# Altium project 415dk.PrjPcb
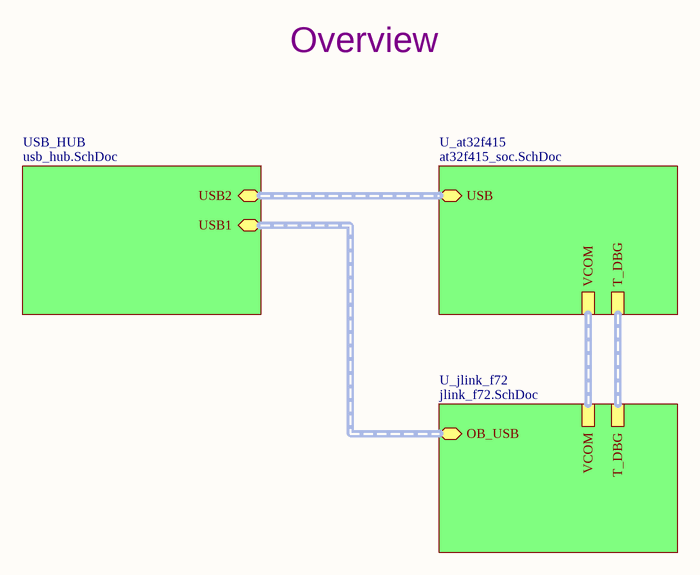
[diagram p0: 415dk.SchDoc]
_Revision_: A; _ProjectName_: 415DK
4 sheets, 63 parts. Net scope: hierarchical (ports join the sheet entries above them; power ports are global).
Board file: 415dk.PcbDoc
Sheets:
  415dk.SchDoc
    U_at32f415 = at32f415_soc.SchDoc
    U_jlink_f72 = jlink_f72.SchDoc
    USB_HUB = usb_hub.SchDoc

## Sheet 415dk.SchDoc
size A4; DocumentNumber: 1; SheetNumber: 1; SheetTotal: 4

### Sub-sheets
U_at32f415 = at32f415_soc.SchDoc: T_DBG (harness DBG_PORT), VCOM (harness VCOM), USB (harness USB)
U_jlink_f72 = jlink_f72.SchDoc: T_DBG (harness DBG_PORT), VCOM (harness VCOM), OB_USB (harness USB)
USB_HUB = usb_hub.SchDoc: USB1, USB2

### Buses and harness runs
harness sheet U_at32f415/T_DBG = sheet U_jlink_f72/T_DBG
harness sheet U_at32f415/USB = sheet USB_HUB/USB2
harness sheet U_at32f415/VCOM = sheet U_jlink_f72/VCOM
harness sheet U_jlink_f72/OB_USB = sheet USB_HUB/USB1

### Notes on the sheet
- Overview

## Sheet at32f415_soc.SchDoc
size A4; DocumentNumber: 2; SheetNumber: 2; SheetTotal: 4
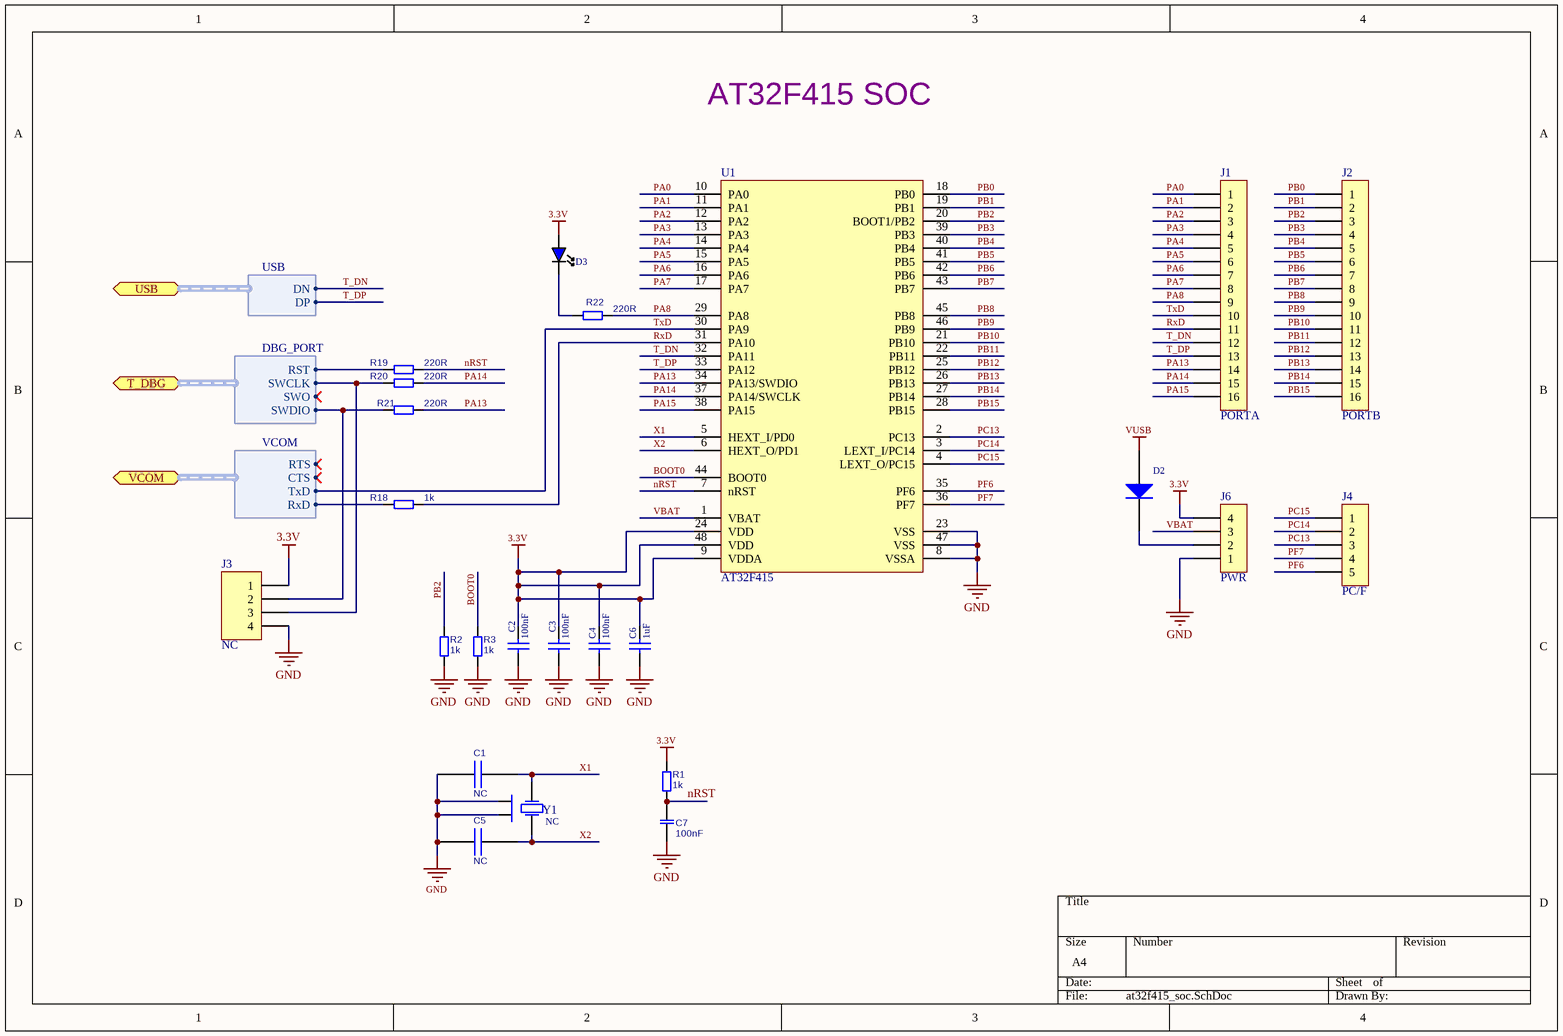
[diagram p1: at32f415_soc.SchDoc]

### Parts
C1  NC  [C0402]  (no BOM)
C2  100nF  [C0402]
C3  100nF  [C0402]
C4  100nF  [C0402]
C5  NC  [C0402]  (no BOM)
C6  1uF  [C0603]
C7  100nF  [C0402]
D2  Diode  [SOD123]  (value not drawn)
D3  User LED  [LED0603]  (value not drawn)
J1  PORTA  [HDR1X16]  (no BOM)
J2  PORTB  [HDR1X16]  (no BOM)
J3  NC  [HDR1X4]  (no BOM)
J4  PC/F  [HDR1X5]  (no BOM)
J6  PWR  [HDR1X4]  (no BOM)
R1  1k  [R0402]
R2  1k  [R0402]
R3  1k  [R0402]
R18  1k  [R0402]
R19  220R  [R0402]
R20  220R  [R0402]
R21  220R  [R0402]
R22  220R  [R0402]
U1  AT32F415  [LQFP48_M]
Y1  NC  [XTAL_3225]  (no BOM)

### Ports
T_DBG (harness DBG_PORT), USB (harness USB), VCOM (harness VCOM)

### Harnesses
DBG_PORT: RST, SWCLK, SWDIO, SWO
VCOM: RTS, CTS, RxD, TxD
USB: DP, DN

### Nets
3.3V: C2.1 C3.1 C4.1 C6.1 D3.A J3.1 J6.4 R1.1(K) U1.9(VDDA) U1.24(VDD) U1.48(VDD)
GND: C1.1(P) C2.2 C3.2 C4.2 C5.1(P) C6.2 C7.1(K) J3.4 J6.1 R2.1(K) R3.2(A) U1.8(VSSA) U1.23(VSS) U1.47(VSS) Y1.2 Y1.4(X2)
VUSB: D2.A
BOOT0: R3.1(K) U1.44(BOOT0)  [project net BOOT0_2]
nRST: C7.2(A) R1.2(A) R19.1(K) U1.7(nRST)  [project net nRST_2]
PA0: J1.1 U1.10(PA0)  [project net PA0_2]
PA1: J1.2 U1.11(PA1)  [project net PA1_2]
PA2: J1.3 U1.12(PA2)  [project net PA2_2]
PA3: J1.4 U1.13(PA3)  [project net PA3_2]
PA4: J1.5 U1.14(PA4)  [project net PA4_2]
PA5: J1.6 U1.15(PA5)  [project net PA5_2]
PA6: J1.7 U1.16(PA6)  [project net PA6_2]
PA7: J1.8 U1.17(PA7)  [project net PA7_2]
PA8: J1.9 R22.1(K) U1.29(PA8)  [project net PA8_2]
PA13: J1.14 R21.1(K) U1.34(PA13/SWDIO)  [project net PA13_2]
PA14: J1.15 R20.1(K) U1.37(PA14/SWCLK)  [project net PA14_2]
PA15: J1.16 U1.38(PA15)  [project net PA15_2]
PB0: J2.1 U1.18(PB0)  [project net PB0_2]
PB1: J2.2 U1.19(PB1)  [project net PB1_2]
PB2: J2.3 R2.2(A) U1.20(BOOT1/PB2)  [project net PB2_2]
PB3: J2.4 U1.39(PB3)  [project net PB3_2]
PB4: J2.5 U1.40(PB4)  [project net PB4_2]
PB5: J2.6 U1.41(PB5)  [project net PB5_2]
PB6: J2.7 U1.42(PB6)  [project net PB6_2]
PB7: J2.8 U1.43(PB7)  [project net PB7_2]
PB8: J2.9 U1.45(PB8)  [project net PB8_2]
PB9: J2.10 U1.46(PB9)  [project net PB9_2]
PB10: J2.11 U1.21(PB10)  [project net PB10_2]
PB11: J2.12 U1.22(PB11)  [project net PB11_2]
PB12: J2.13 U1.25(PB12)  [project net PB12_2]
PB13: J2.14 U1.26(PB13)  [project net PB13_2]
PB14: J2.15 U1.27(PB14)  [project net PB14_2]
PB15: J2.16 U1.28(PB15)  [project net PB15_2]
PC13: J4.3 U1.2(PC13)  [project net PC13_2]
PC14: J4.2 U1.3(LEXT_I/PC14)  [project net PC14_2]
PC15: J4.1 U1.4(LEXT_O/PC15)  [project net PC15_2]
PF6: J4.5 U1.35(PF6)  [project net PF6_2]
PF7: J4.4 U1.36(PF7)  [project net PF7_2]
RxD: J1.11 R18.2(A) U1.31(PA10)  [project net RxD_2]
T_DN: J1.12 U1.32(PA11) ; port USB.DN
T_DP: J1.13 U1.33(PA12) ; port USB.DP
T_nRST: R19.2(A) ; port T_DBG.RST
T_RxD: R18.1(K) ; port VCOM.RxD
T_SWCLK: J3.3 R20.2(A) ; port T_DBG.SWCLK
T_SWDIO: J3.2 R21.2(A) ; port T_DBG.SWDIO
TxD: J1.10 U1.30(PA9) ; port VCOM.TxD  [project net T_TxD]
VBAT: J6.3 U1.1(VBAT)  [project net VBAT_2]
X1: C1.2(N) U1.5(HEXT_I/PD0) Y1.1(X1)  [project net X1_2]
X2: C5.2(N) U1.6(HEXT_O/PD1) Y1.3(X2)  [project net X2_2]
NetD2_K: D2.K J6.2
NetD3_k: D3.k R22.2(A)

### Notes on the sheet
- AT32F415 SOC

### Library data of the parts
C1 C5 = Cap1: Ceramic Capacitor; Type: SMD; ComponentLink1URL: *; ComponentLink1Description: *; Tolerance: *; Value: NC
C2-C4 C6 = Cap: Capacitor; Published: 8-Jun-2000; LatestRevisionDate: 17-Jul-2002; LatestRevisionNote: Re-released for DXP Platform.; PackageReference: RAD-0.3; Publisher: Altium Limited; PackageDescription: Radial Cap, Thru-Hole; 2 Leads; 0.3 in Pin Spacing
  C2-C4: Value: 100nF
  C6: Value: 1uF
C7 = Cap: Ceramic Capacitor; Type: SMD; ComponentLink1URL: *; ComponentLink1Description: *; Tolerance: *; Value: 100nF
D2 = Diode: Generic Diode; Value: *
D3 = LED_BLUE: Green LED; Part Number: 150060VS75020; Value: *
J1 J2 = HEADER1x16: 100mil, 1x16 header
J3 = Header 4: Header, 4-Pin; LatestRevisionDate: 17-Jul-2002; LatestRevisionNote: Re-released for DXP Platform.; Value: NC
J4 = HEADER1X5: 100mil, 1x5 header
J6 = HEADER1X4: 100mil, 1x4 header
R1-R3 R18-R22 = Res: Resistor; ComponentLink1URL: *; ComponentLink1Description: *; Tolerance: *; Type: SMD
  R1-R3 R18: Value: 1k
  R19-R22: Value: 220R
U1 = AT32F415: Cortex-M4 MCU
Y1 = XTAL_4_PIN: 12Mhz CERAMIC SMD CRYSTAL; Value: NC; ComponentLink1Description: DataSheet

## Sheet jlink_f72.SchDoc
size A4; DocumentNumber: 3; SheetNumber: 3; SheetTotal: 4
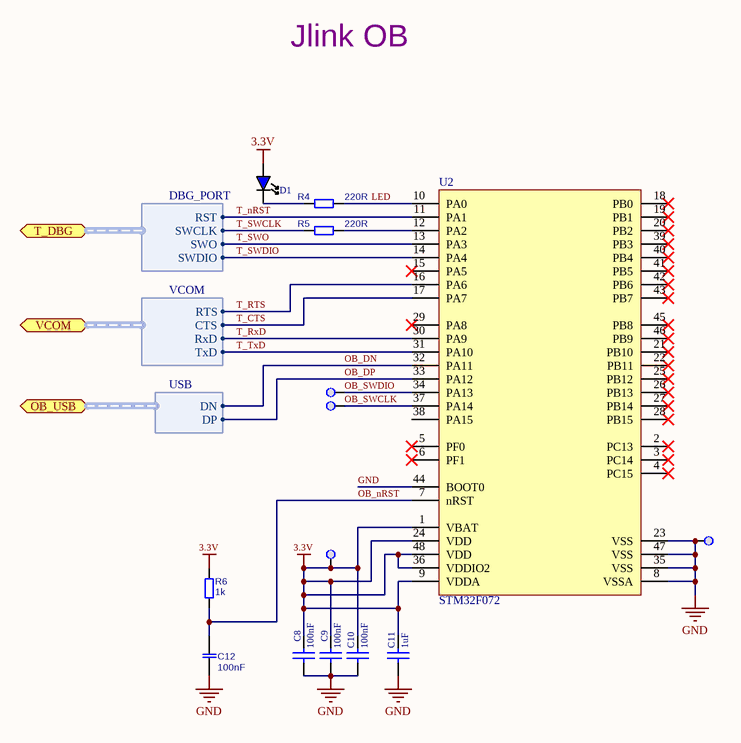
[diagram p2: jlink_f72.SchDoc]

### Parts
C8  100nF  [C0402]
C9  100nF  [C0402]
C10  100nF  [C0402]
C11  1uF  [C0603]
C12  100nF  [C0402]
D1  Debugger LED  [LED0603]  (value not drawn)
R4  220R  [R0402]
R5  220R  [R0402]
R6  1k  [R0402]
TP1  TestPoint  [PAD1_07]  (value not drawn)  (no BOM)
TP2  TestPoint  [PAD1_07]  (value not drawn)  (no BOM)
TP3  TestPoint  [PAD1_07]  (value not drawn)  (no BOM)
TP4  TestPoint  [PAD1_07]  (value not drawn)  (no BOM)
U2  STM32F072  [LQFP48_M]

### Ports
OB_USB (harness USB), T_DBG (harness DBG_PORT), VCOM (harness VCOM)

### Harnesses
DBG_PORT: RST, SWCLK, SWDIO, SWO
VCOM: RTS, CTS, RxD, TxD
USB: DP, DN

### Nets
3.3V: C8.1 C9.1 C10.1 C11.1 D1.A R6.1(K) TP4.1 U2.1(VBAT) U2.9(VDDA) U2.24(VDD) U2.36(VDDIO2) U2.48(VDD)
GND: C8.2 C9.2 C10.2 C11.2 C12.1(K) TP3.1 U2.8(VSSA) U2.23(VSS) U2.35(VSS) U2.44(BOOT0) U2.47(VSS)
LED: R4.1(K) U2.10(PA0)  [project net LED_3]
OB_DN: U2.32(PA11) ; port OB_USB.DN
OB_DP: U2.33(PA12) ; port OB_USB.DP
OB_nRST: C12.2(A) R6.2(A) U2.7(nRST)  [project net OB_nRST_3]
OB_SWCLK: TP2.1 U2.37(PA14)  [project net OB_SWCLK_3]
OB_SWDIO: TP1.1 U2.34(PA13)  [project net OB_SWDIO_3]
T_CTS: U2.17(PA7) ; port VCOM.CTS
T_nRST: U2.11(PA1) ; port T_DBG.RST
T_RTS: U2.16(PA6) ; port VCOM.RTS
T_RxD: U2.30(PA9) ; port VCOM.RxD
T_SWCLK: R5.2(A) ; port T_DBG.SWCLK
T_SWDIO: U2.14(PA4) ; port T_DBG.SWDIO
T_SWO: U2.13(PA3) ; port T_DBG.SWO
T_TxD: U2.31(PA10) ; port VCOM.TxD
NetD1_k: D1.k R4.2(A)
NetR5_1: R5.1(K) U2.12(PA2)

Not connected (* = marked no-connect by the designer): U2 2(PC13)* 3(PC14)* 4(PC15)* 5(PF0)* 6(PF1)* 15(PA5)* 18(PB0)* 19(PB1)* 20(PB2)* 21(PB10)* 22(PB11)* 25(PB12)* 26(PB13)* 27(PB14)* 28(PB15)* 29(PA8)* 38(PA15) 39(PB3)* 40(PB4)* 41(PB5)* 42(PB6)* 43(PB7)* 45(PB8)* 46(PB9)*

### Notes on the sheet
- Jlink OB

### Library data of the parts
C8-C11 = Cap: Capacitor; Published: 8-Jun-2000; LatestRevisionDate: 17-Jul-2002; LatestRevisionNote: Re-released for DXP Platform.; PackageReference: RAD-0.3; Publisher: Altium Limited; PackageDescription: Radial Cap, Thru-Hole; 2 Leads; 0.3 in Pin Spacing
  C8-C10: Value: 100nF
  C11: Value: 1uF
C12 = Cap: Ceramic Capacitor; Type: SMD; ComponentLink1URL: *; ComponentLink1Description: *; Tolerance: *; Value: 100nF
D1 = LED_BLUE: RED LED; Value: *
R4-R6 = Res: Resistor; ComponentLink1URL: *; ComponentLink1Description: *; Tolerance: *; Type: SMD
  R4 R5: Value: 220R
  R6: Value: 1k
TP1-TP4 = TestPoint: Test point
U2 = STM32F072: Cortex-M0 MCU

## Sheet usb_hub.SchDoc
size A4; DocumentNumber: 4; SheetNumber: 4; SheetTotal: 4
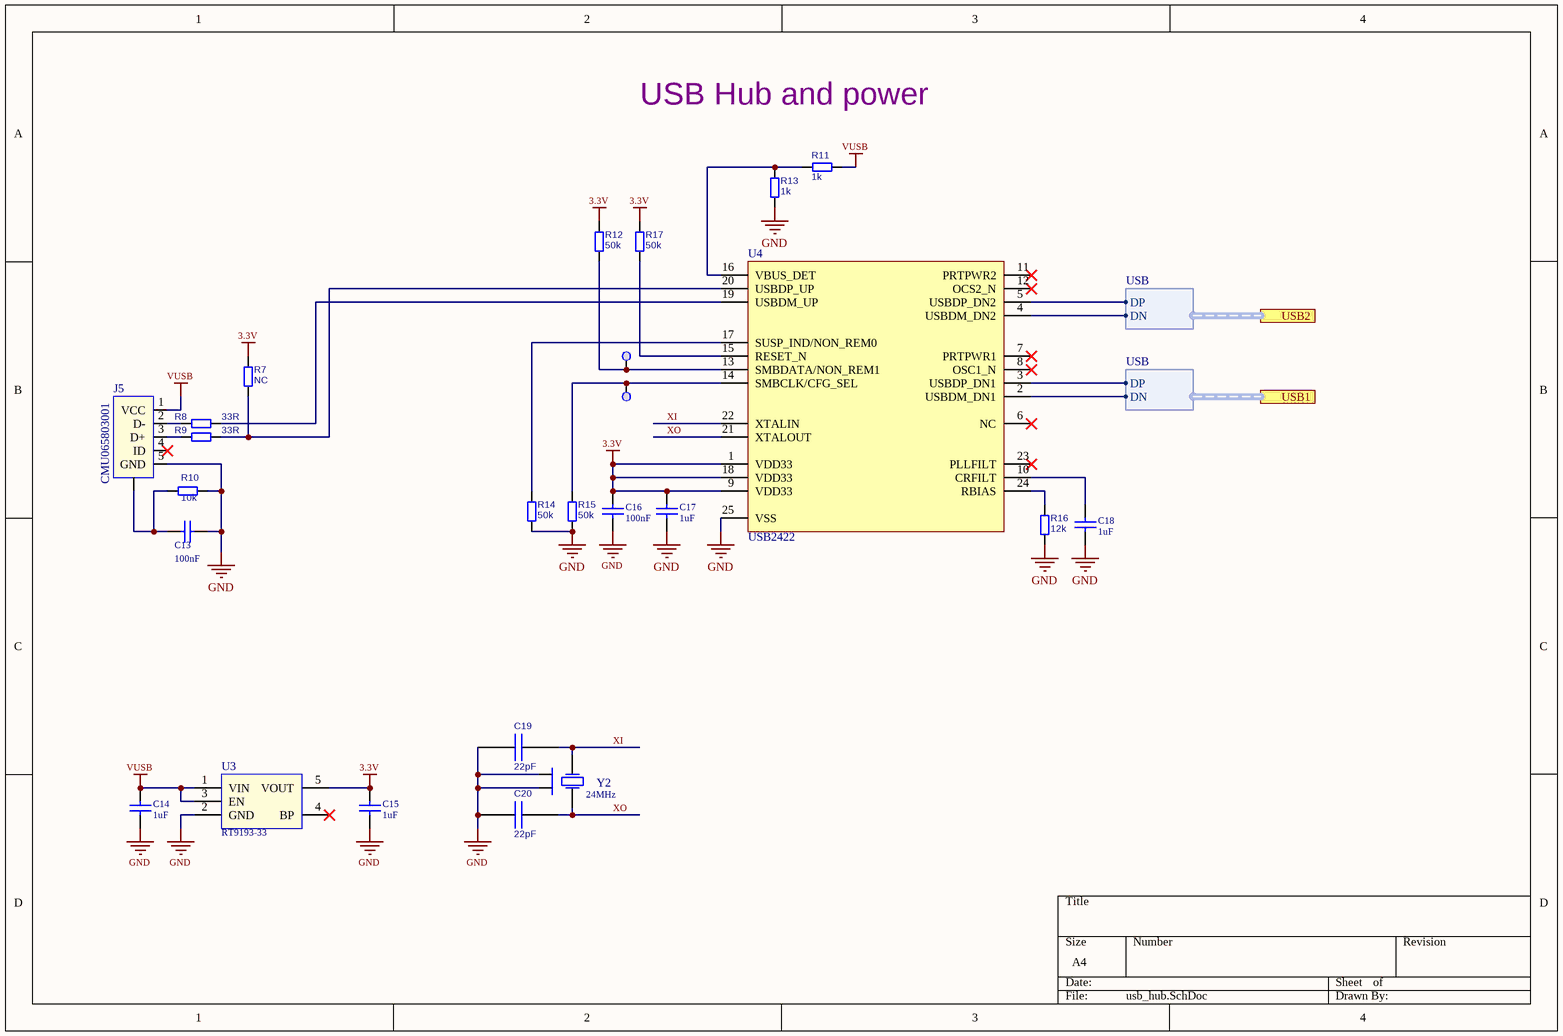
[diagram p3: usb_hub.SchDoc]

### Parts
C13  100nF  [C0402]
C14  1uF  [C0603]
C15  1uF  [C0603]
C16  100nF  [C0402]
C17  1uF  [C0603]
C18  1uF  [C0603]
C19  22pF  [C0402]
C20  22pF  [C0402]
J5  CMU065803001  [CMU065803001]
R7  NC  [R0402]
R8  33R  [R0402]
R9  33R  [R0402]
R10  10k  [R0402]
R11  1k  [R0402]
R12  50k  [R0402]
R13  1k  [R0402]
R14  50k  [R0402]
R15  50k  [R0402]
R16  12k  [R0402]
R17  50k  [R0402]
TP5  TestPoint  [PAD1_07]  (value not drawn)  (no BOM)
TP6  TestPoint  [PAD1_07]  (value not drawn)  (no BOM)
U3  RT9193-33  [SOT23-5]
U4  USB2422  [QFN-24_4040]
Y2  24MHz  [XTAL_3225]

### Ports
USB1 (harness USB), USB2 (harness USB)

### Harnesses
USB: DP, DN

### Nets
3.3V: C15.2 C16.2 C17.2 R7.1(K) R12.2(A) R17.2(A) U3.5(VOUT) U4.1(VDD33) U4.9(VDD33) U4.18(VDD33)
GND: C13.2 C14.1 C15.1 C16.1 C17.1 C18.1 C19.1(P) C20.1(P) J5.5(GND) R10.1(K) R13.1(K) R14.1(K) R15.1(K) R16.1(K) U3.2(GND) U4.25(VSS) Y2.2 Y2.4(X2)
VUSB: C14.2 J5.1(VCC) R11.1(K) U3.1(VIN) U3.3(EN)
OB_DN: U4.2(USBDM_DN1) ; port USB1.DN
OB_DP: U4.3(USBDP_DN1) ; port USB1.DP
T_DN: U4.4(USBDM_DN2) ; port USB2.DN
T_DP: U4.5(USBDP_DN2) ; port USB2.DP
XI: C19.2(N) U4.22(XTALIN) Y2.1(X1)  [project net XI_4]
XO: C20.2(N) U4.21(XTALOUT) Y2.3(X2)  [project net XO_4]
NetC13_1: C13.1 J5.0 R10.2(A)
NetC18_2: C18.2 U4.10(CRFILT)
NetJ5_2: J5.2(D-) R8.2(A)
NetJ5_3: J5.3(D+) R9.2(A)
NetR7_2: R7.2(A) R9.1(K) U4.20(USBDP_UP)
NetR8_1: R8.1(K) U4.19(USBDM_UP)
NetR11_2: R11.2(A) R13.2(A) U4.16(VBUS_DET)
NetR12_1: R12.1(K) TP5.1 U4.13(SMBDATA/NON_REM1)
NetR14_2: R14.2(A) U4.17(SUSP_IND/NON_REM0)
NetR15_2: R15.2(A) TP6.1 U4.14(SMBCLK/CFG_SEL)
NetR16_2: R16.2(A) U4.24(RBIAS)
NetR17_1: R17.1(K) U4.15(RESET_N)

Not connected (* = marked no-connect by the designer): J5 4(ID)*; U3 4(BP)*; U4 6(NC)* 7(PRTPWR1)* 8(OSC1_N)* 11(PRTPWR2)* 12(OCS2_N)* 23(PLLFILT)*

### Notes on the sheet
- USB Hub and power

### Library data of the parts
C13-C18 = Cap: Capacitor; Published: 8-Jun-2000; LatestRevisionDate: 17-Jul-2002; LatestRevisionNote: Re-released for DXP Platform.; PackageReference: RAD-0.3; Publisher: Altium Limited; PackageDescription: Radial Cap, Thru-Hole; 2 Leads; 0.3 in Pin Spacing
  C13 C16: Value: 100nF
  C14 C15 C17 C18: Value: 1uF
C19 C20 = Cap1: Ceramic Capacitor; Type: SMD; ComponentLink1URL: *; ComponentLink1Description: *; Tolerance: *; Value: 22pF
J5 = CMU065803001: MICRO USB 5P FEMALE DIP B -TYPE; Manufacturer: CSCONN; Value: CMU065803001; ComponentLink1Description: Datasheet; ComponentLink1URL: http://www.csconn.com/file/Upload/Upload/CMU065803001.pdf; PartNumber: CMU065803001
R7-R17 = Res: Resistor; ComponentLink1URL: *; ComponentLink1Description: *; Tolerance: *; Type: SMD
  R7: Value: NC
  R8 R9: Value: 33R
  R10: Value: 10k
  R11 R13: Value: 1k
  R12 R14 R15 R17: Value: 50k
  R16: Value: 12k
TP5 TP6 = TestPoint: Test point
U3 = RT9193: 300mA, Ultra-Low Noise, Ultra-Fast CMOS LDO Regulator; Manufacturer: RICHTEK; Value: RT9193; ComponentLink1Description: DataSheet; ComponentLink1URL: http://www.richtek.com/assets/product_file/RT9193/DS9193-16.pdf; PartNumber: RT9193-33
U4 = USB2422: USB 2.0 Hi-Speed 2-port Hub Controller; MAnufacturer: Microchip; Datasheet: https://ww1.microchip.com/downloads/aemDocuments/documents/OTH/ProductDocuments/DataSheets/00001726B.pdf; Evaluation Board: https://ww1.microchip.com/downloads/aemDocuments/documents/OTH/ProductDocuments/BoardDesignFiles/evb2422sch.pdf
Y2 = XTAL_4_PIN: 24Mhz CERAMIC SMD CRYSTAL; Value: 24MHz; ComponentLink1Description: DataSheet

## Nets that join several sheets
3.3V: at32f415_soc (11 pins), jlink_f72 (12 pins), usb_hub (10 pins)
GND: at32f415_soc (16 pins), jlink_f72 (11 pins), usb_hub (18 pins)
VUSB: at32f415_soc (D2.A), usb_hub (5 pins)
OB_DN: jlink_f72 (U2.32), usb_hub (U4.2)
OB_DP: jlink_f72 (U2.33), usb_hub (U4.3)
T_DN: at32f415_soc (J1.12 U1.32), usb_hub (U4.4)
T_DP: at32f415_soc (J1.13 U1.33), usb_hub (U4.5)
T_nRST: at32f415_soc (R19.2), jlink_f72 (U2.11)
T_RxD: at32f415_soc (R18.1), jlink_f72 (U2.30)
T_SWCLK: at32f415_soc (J3.3 R20.2), jlink_f72 (R5.2)
T_SWDIO: at32f415_soc (J3.2 R21.2), jlink_f72 (U2.14)
T_TxD: at32f415_soc (J1.10 U1.30), jlink_f72 (U2.31)